# Altium schematic sheet CURRENT_MEASURE_AC.SchDoc
size A4
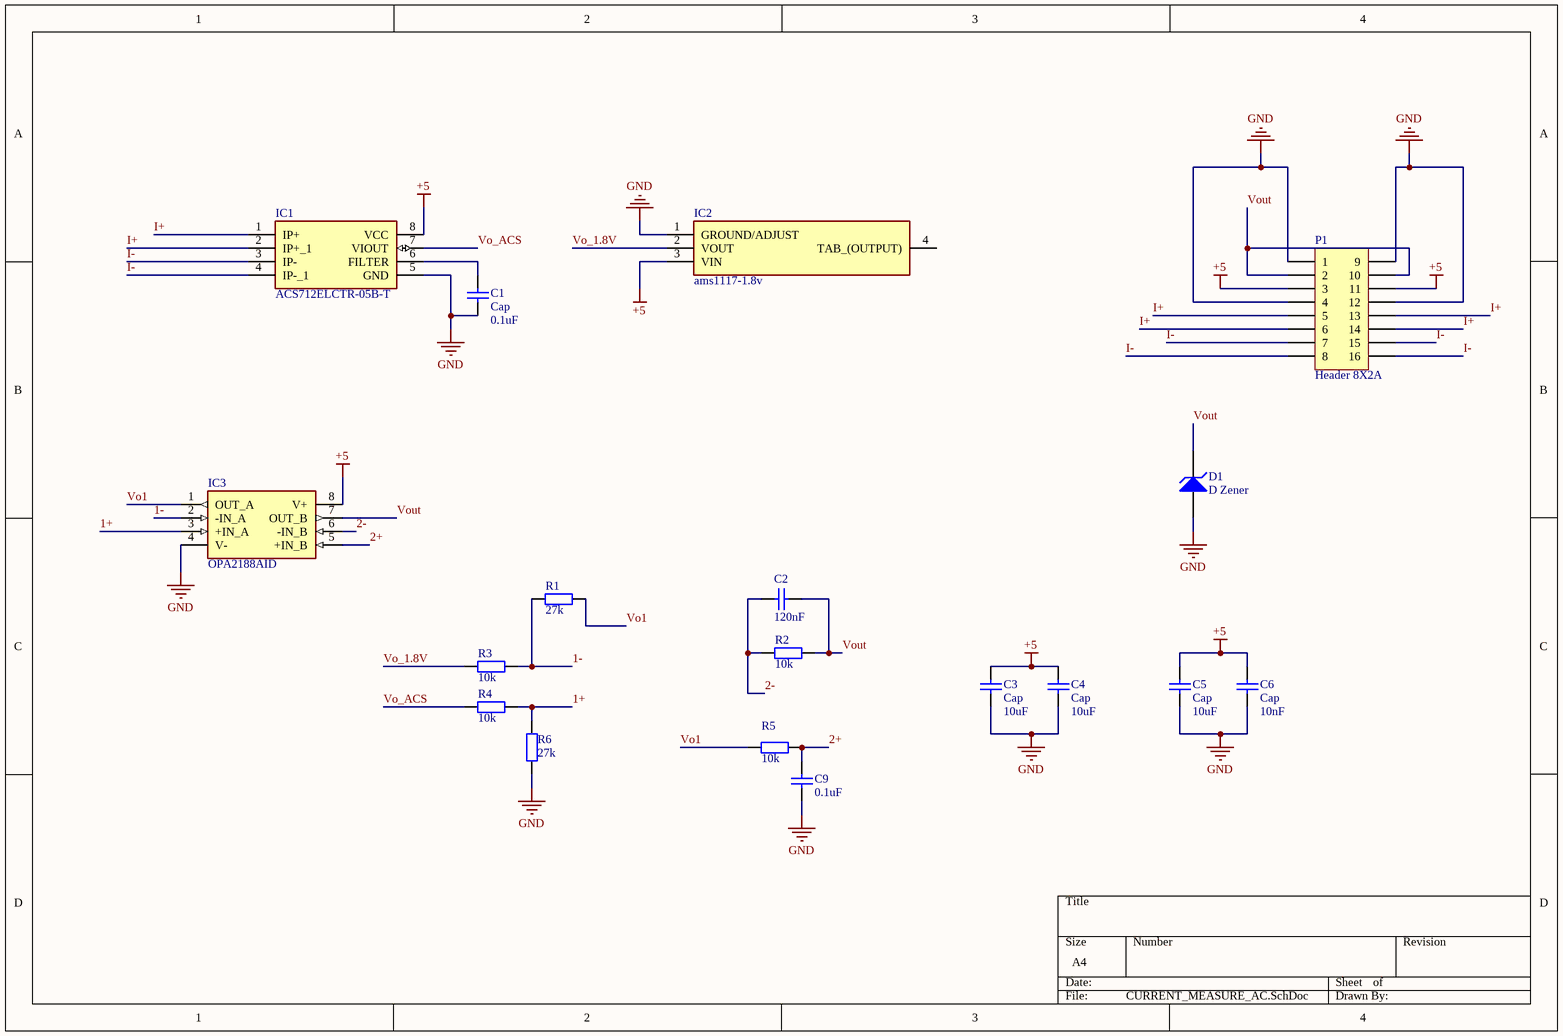
[diagram p0: CURRENT_MEASURE_AC.SchDoc]

## Parts
C1  Cap  value 0.1uF  [1608[0603]]
C2  value 120nF  [1608[0603]]  (hidden comment: Cap)
C3  Cap  value 10uF  [1608[0603]]
C4  Cap  value 10uF  [1608[0603]]
C5  Cap  value 10uF  [1608[0603]]
C6  Cap  value 10nF  [1608[0603]]
C9  value 0.1uF  [1608[0603]]  (hidden comment: Cap)
D1  D Zener  [C1206]
IC1  ACS712ELCTR-05B-T  [SOIC127P600X175-8N]
IC2  ams1117-1.8v  [SOT229P700X180-4N]
IC3  OPA2188AID  [SOIC127P600X175-8N]
P1  Header 8X2A  [HDR2X8_CEN]
R1  value 27k  [1608[0603]]  (hidden comment: Res2)
R2  value 10k  [1608[0603]]  (hidden comment: Res2)
R3  value 10k  [1608[0603]]  (hidden comment: Res2)
R4  value 10k  [AXIAL-0.3]  (hidden comment: Res2)
R5  value 10k  [AXIAL-0.3]  (hidden comment: Res2)
R6  value 27k  [1608[0603]]  (hidden comment: Res2)

## Nets
+5: C3.2 C4.2 C5.2 C6.1 IC1.8(VCC) IC2.3(VIN) IC3.8(V+) P1.3 P1.11
GND: C1.2 C3.1 C4.1 C5.1 C6.2 C9.1 D1.1(A) IC1.5(GND) IC2.1(GROUND/ADJUST) IC3.4(V-) P1.1 P1.4 P1.9 P1.12 R6.1
1+: IC3.3(+IN_A) R4.2 R6.2
1-: IC3.2(-IN_A) R1.1 R3.2
2+: C9.2 IC3.5(+IN_B) R5.2
2-: C2.1 IC3.6(-IN_B) R2.1
I+: IC1.1(IP+) IC1.2(IP+_1) P1.5 P1.6 P1.13 P1.14
I-: IC1.3(IP-) IC1.4(IP-_1) P1.7 P1.8 P1.15 P1.16
Vo1: IC3.1(OUT_A) R1.2 R5.1
Vo_1.8V: IC2.2(VOUT) R3.1
Vo_ACS: IC1.7(VIOUT) R4.1
Vout: C2.2 D1.2(K) IC3.7(OUT_B) P1.2 P1.10 R2.2
NetC1_1: C1.1 IC1.6(FILTER)

Not connected (* = marked no-connect by the designer): IC2 4(TAB_(OUTPUT))

## Library data of the parts
C1-C6 C9 = Cap: Capacitor; Published: 8-Jun-2000; LatestRevisionDate: 17-Jul-2002; LatestRevisionNote: Re-released for DXP Platform.; PackageReference: RAD-0.3; Publisher: Altium Limited; PackageDescription: Radial Cap, Thru-Hole; 2 Leads; 0.3 in Pin Spacing
D1 = D Zener: Zener Diode; Published: 8-Jun-2000; LatestRevisionDate: 17-Jul-2002; LatestRevisionNote: Re-released for DXP Platform.; PackageReference: DIODE-0.7; Publisher: Altium Limited; PackageDescription: Diode, Thru-Hole; 2 Leads; 0.7 in Pin Spacing
IC1 = ACS712ELCTR-05B-T: Integrated Circuit; Manufacturer_Name: Allegro Microsystems; Allied_Number: R1076681; Datasheet Link: http://docs-emea.rs-online.com/webdocs/0d88/0900766b80d885f5.pdf; Height: 1.75mm; Manufacturer_Part_Number: ACS712ELCTR-05B-T; RS Part Number: 1729270; RS Price/Stock: http://uk.rs-online.com/web/p/products/1729270; Allied Price/Stock: http://www.alliedelec.com/allegro-microsystems-acs712elctr-05b-t/R1076681/
IC2 = ams1117-3.3v: Integrated Circuit; Manufacturer_Name: Advanced Monolithic Systems; Datasheet Link: http://www.advanced-monolithic.com/pdf/ds1117.pdf; Height: 1.8mm; Manufacturer_Part_Number: ams1117-3.3v
IC3 = OPA2188AID: Integrated Circuit; Manufacturer_Name: Texas Instruments; Datasheet Link: http://www.ti.com/lit/ds/symlink/opa2188.pdf; Height: 1.75mm; Manufacturer_Part_Number: OPA2188AID; Mouser Part Number: 595-OPA2188AID; Mouser Price/Stock: https://www.mouser.com/Search/Refine.aspx?Keyword=595-OPA2188AID; RS Part Number: 9212845; RS Price/Stock: https://uk.rs-online.com/web/p/products/9212845
P1 = Header 8X2A: Header, 8-Pin, Dual row; LatestRevisionDate: 17-Jul-2002; LatestRevisionNote: Re-released for DXP Platform.; Publisher: Altium Limited
R1-R6 = Res2: Resistor; Published: 8-Jun-2000; LatestRevisionDate: 17-Jul-2002; LatestRevisionNote: Re-released for DXP Platform.; PackageReference: AXIAL-0.4; Publisher: Altium Limited; PackageDescription: Axial Device, Thru-Hole; 2 Leads; 0.4 in Pin Spacing